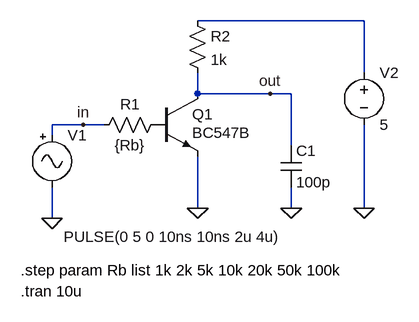
[diagram p0: schematic 3.4.asc]
3.4.asc, the LTspice schematic file:
Version 4
SHEET 1 880 680
WIRE 256 -128 0 -128
WIRE 256 -48 256 -128
WIRE 0 -16 0 -48
WIRE 112 -16 0 -16
WIRE 144 -16 112 -16
WIRE -176 32 -224 32
WIRE -144 32 -176 32
WIRE -224 48 -224 32
WIRE 144 64 144 -16
WIRE 0 160 0 80
WIRE 144 160 144 128
WIRE 256 160 256 32
WIRE -224 176 -224 128
FLAG -224 176 0
FLAG 0 160 0
FLAG 144 160 0
FLAG 256 160 0
FLAG -176 32 in
FLAG 112 -16 out
SYMBOL Misc\\signal -224 32 R0
WINDOW 123 0 0 Left 2
WINDOW 39 0 0 Left 2
WINDOW 3 18 172 Left 2
SYMATTR InstName V1
SYMATTR Value PULSE(0 5 0 10ns 10ns 2u 4u)
SYMBOL res -48 16 R90
WINDOW 0 0 56 VBottom 2
WINDOW 3 32 56 VTop 2
SYMATTR InstName R1
SYMATTR Value {Rb}
SYMBOL res -16 -144 R0
SYMATTR InstName R2
SYMATTR Value 1k
SYMBOL voltage 256 -64 R0
WINDOW 123 0 0 Left 2
WINDOW 39 0 0 Left 2
SYMATTR InstName V2
SYMATTR Value 5
SYMBOL cap 128 64 R0
SYMATTR InstName C1
SYMATTR Value 100p
SYMBOL npn -64 -16 R0
WINDOW 3 56 60 Left 2
SYMATTR Value BC547B
SYMATTR InstName Q1
TEXT -272 256 Left 2 !.step param Rb list 1k 2k 5k 10k 20k 50k 100k
TEXT -272 288 Left 2 !.tran 10u

The netlist it stands for:
* 3.4.asc
V1 in 0 PULSE(0 5 0 10ns 10ns 2u 4u)
R1 P001 in {Rb}
R2 N001 out 1k
V2 N001 0 5
C1 out 0 100p
Q1 out P001 0 0 BC547B
.model NPN NPN
.model PNP PNP
.lib standard.bjt
.step param Rb list 1k 2k 5k 10k 20k 50k 100k
.tran 10u
.backanno
.end